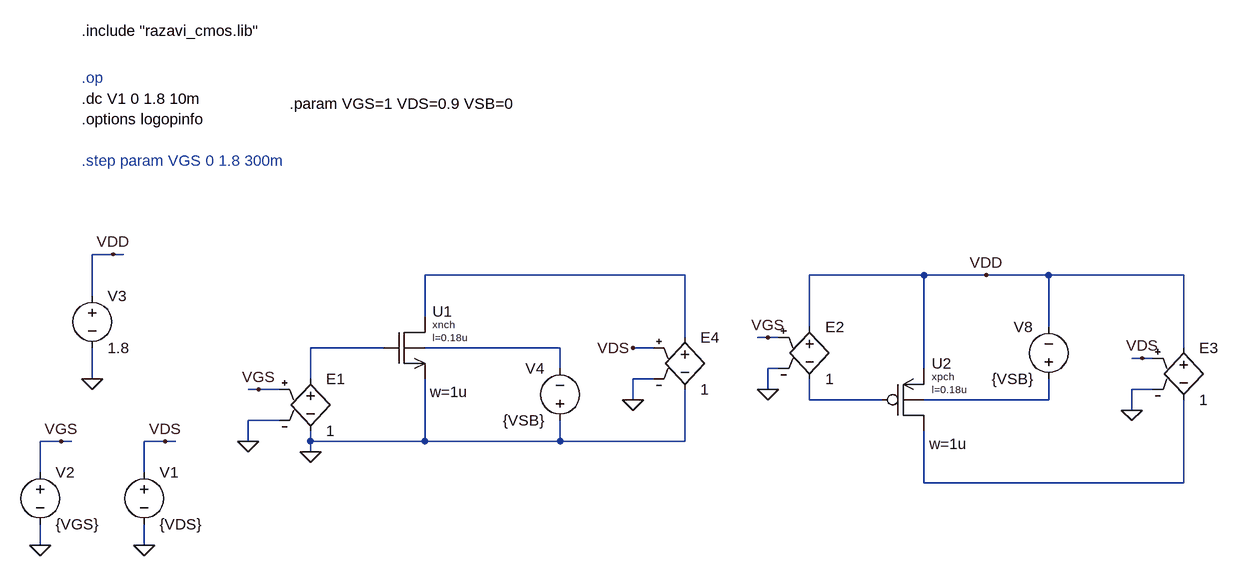
[diagram p0: schematic DC_Sweep_Razavi.asc]
DC_Sweep_Razavi.asc, the LTspice schematic file:
Version 4.1
SHEET 1 6080 1492
WIRE 176 -32 144 -32
WIRE 192 -32 176 -32
WIRE 1056 0 656 0
WIRE 1424 0 1248 0
WIRE 1520 0 1424 0
WIRE 1616 0 1520 0
WIRE 1824 0 1616 0
WIRE 144 32 144 -32
WIRE 656 64 656 0
WIRE 1248 80 1248 0
WIRE 1616 80 1616 0
WIRE 1056 96 1056 0
WIRE 1184 96 1168 96
WIRE 1200 96 1184 96
WIRE 592 112 480 112
WIRE 864 112 656 112
WIRE 1008 112 976 112
WIRE 1824 112 1824 0
WIRE 1760 128 1744 128
WIRE 1776 128 1760 128
WIRE 864 144 864 112
WIRE 1200 144 1184 144
WIRE 1424 144 1424 0
WIRE 144 160 144 112
WIRE 480 160 480 112
WIRE 1008 160 976 160
WIRE 400 176 384 176
WIRE 432 176 400 176
WIRE 1184 176 1184 144
WIRE 1776 176 1744 176
WIRE 976 192 976 160
WIRE 1248 192 1248 160
WIRE 1360 192 1248 192
WIRE 1616 192 1616 160
WIRE 1616 192 1424 192
WIRE 1744 208 1744 176
WIRE 432 224 384 224
WIRE 96 256 64 256
WIRE 112 256 96 256
WIRE 256 256 224 256
WIRE 272 256 256 256
WIRE 384 256 384 224
WIRE 480 256 480 240
WIRE 656 256 656 160
WIRE 656 256 480 256
WIRE 864 256 864 224
WIRE 864 256 656 256
WIRE 1056 256 1056 176
WIRE 1056 256 864 256
WIRE 480 272 480 256
WIRE 64 304 64 256
WIRE 224 304 224 256
WIRE 1424 320 1424 240
WIRE 1824 320 1824 192
WIRE 1824 320 1424 320
WIRE 64 416 64 384
WIRE 224 416 224 384
FLAG 176 -32 VDD
FLAG 144 160 0
FLAG 480 272 0
FLAG 1520 0 VDD
FLAG 384 256 0
FLAG 1184 176 0
FLAG 64 416 0
FLAG 96 256 VGS
FLAG 400 176 VGS
FLAG 1184 96 VGS
FLAG 1744 208 0
FLAG 976 192 0
FLAG 1760 128 VDS
FLAG 976 112 VDS
FLAG 224 416 0
FLAG 256 256 VDS
SYMBOL voltage 144 16 R0
WINDOW 123 0 0 Left 0
WINDOW 39 0 0 Left 0
SYMATTR InstName V3
SYMATTR Value 1.8
SYMBOL voltage 864 240 R180
WINDOW 0 24 96 Left 2
WINDOW 3 24 16 Left 2
SYMATTR InstName V4
SYMATTR Value {VSB}
SYMBOL voltage 1616 176 R180
WINDOW 0 24 96 Left 2
WINDOW 3 24 16 Left 2
SYMATTR InstName V8
SYMATTR Value {VSB}
SYMBOL e 480 144 R0
SYMATTR InstName E1
SYMATTR Value 1
SYMBOL e 1248 64 R0
SYMATTR InstName E2
SYMATTR Value 1
SYMBOL voltage 64 288 R0
SYMATTR InstName V2
SYMATTR Value {VGS}
SYMBOL e 1824 96 R0
SYMATTR InstName E3
SYMATTR Value 1
SYMBOL e 1056 80 R0
SYMATTR InstName E4
SYMATTR Value 1
SYMBOL voltage 224 288 R0
SYMATTR InstName V1
SYMATTR Value {VDS}
SYMBOL xnch 608 64 R0
WINDOW 123 56 116 Left 2
SYMATTR Value2 w=1u
SYMATTR InstName U1
SYMATTR Value l=0.18u
SYMATTR SpiceModel xnch
SYMBOL xpch 1376 144 R0
WINDOW 123 56 116 Left 2
SYMATTR Value2 w=1u
SYMATTR InstName U2
SYMATTR Value l=0.18u
SYMATTR SpiceModel xpch
TEXT 128 -304 Left 2 ;.op
TEXT 128 -272 Left 2 !.dc V1 0 1.8 10m
TEXT 448 -264 Left 2 !.param VGS=1 VDS=0.9 VSB=0
TEXT 128 -176 Left 2 ;.step param VGS 0 1.8 300m
TEXT 128 -376 Left 2 !.include "razavi_cmos.lib"
TEXT 128 -240 Left 2 !.options logopinfo

The netlist it stands for:
* DC_Sweep_Razavi.asc
V3 VDD 0 1.8
V4 0 N003 {VSB}
V8 N005 VDD {VSB}
E1 N002 0 VGS 0 1
E2 VDD N004 VGS 0 1
V2 VGS 0 {VGS}
E3 VDD N006 VDS 0 1
E4 N001 0 VDS 0 1
V1 VDS 0 {VDS}
X§U1 N001 N002 0 N003 xnch l=0.18u w=1u  ; pins D G S B
X§U2 N006 N004 VDD N005 xpch l=0.18u w=1u  ; pins D G S B
* .op
.dc V1 0 1.8 10m
.param VGS=1 VDS=0.9 VSB=0
* .step param VGS 0 1.8 300m
.include "razavi_cmos.lib"
.options logopinfo
.backanno
.end